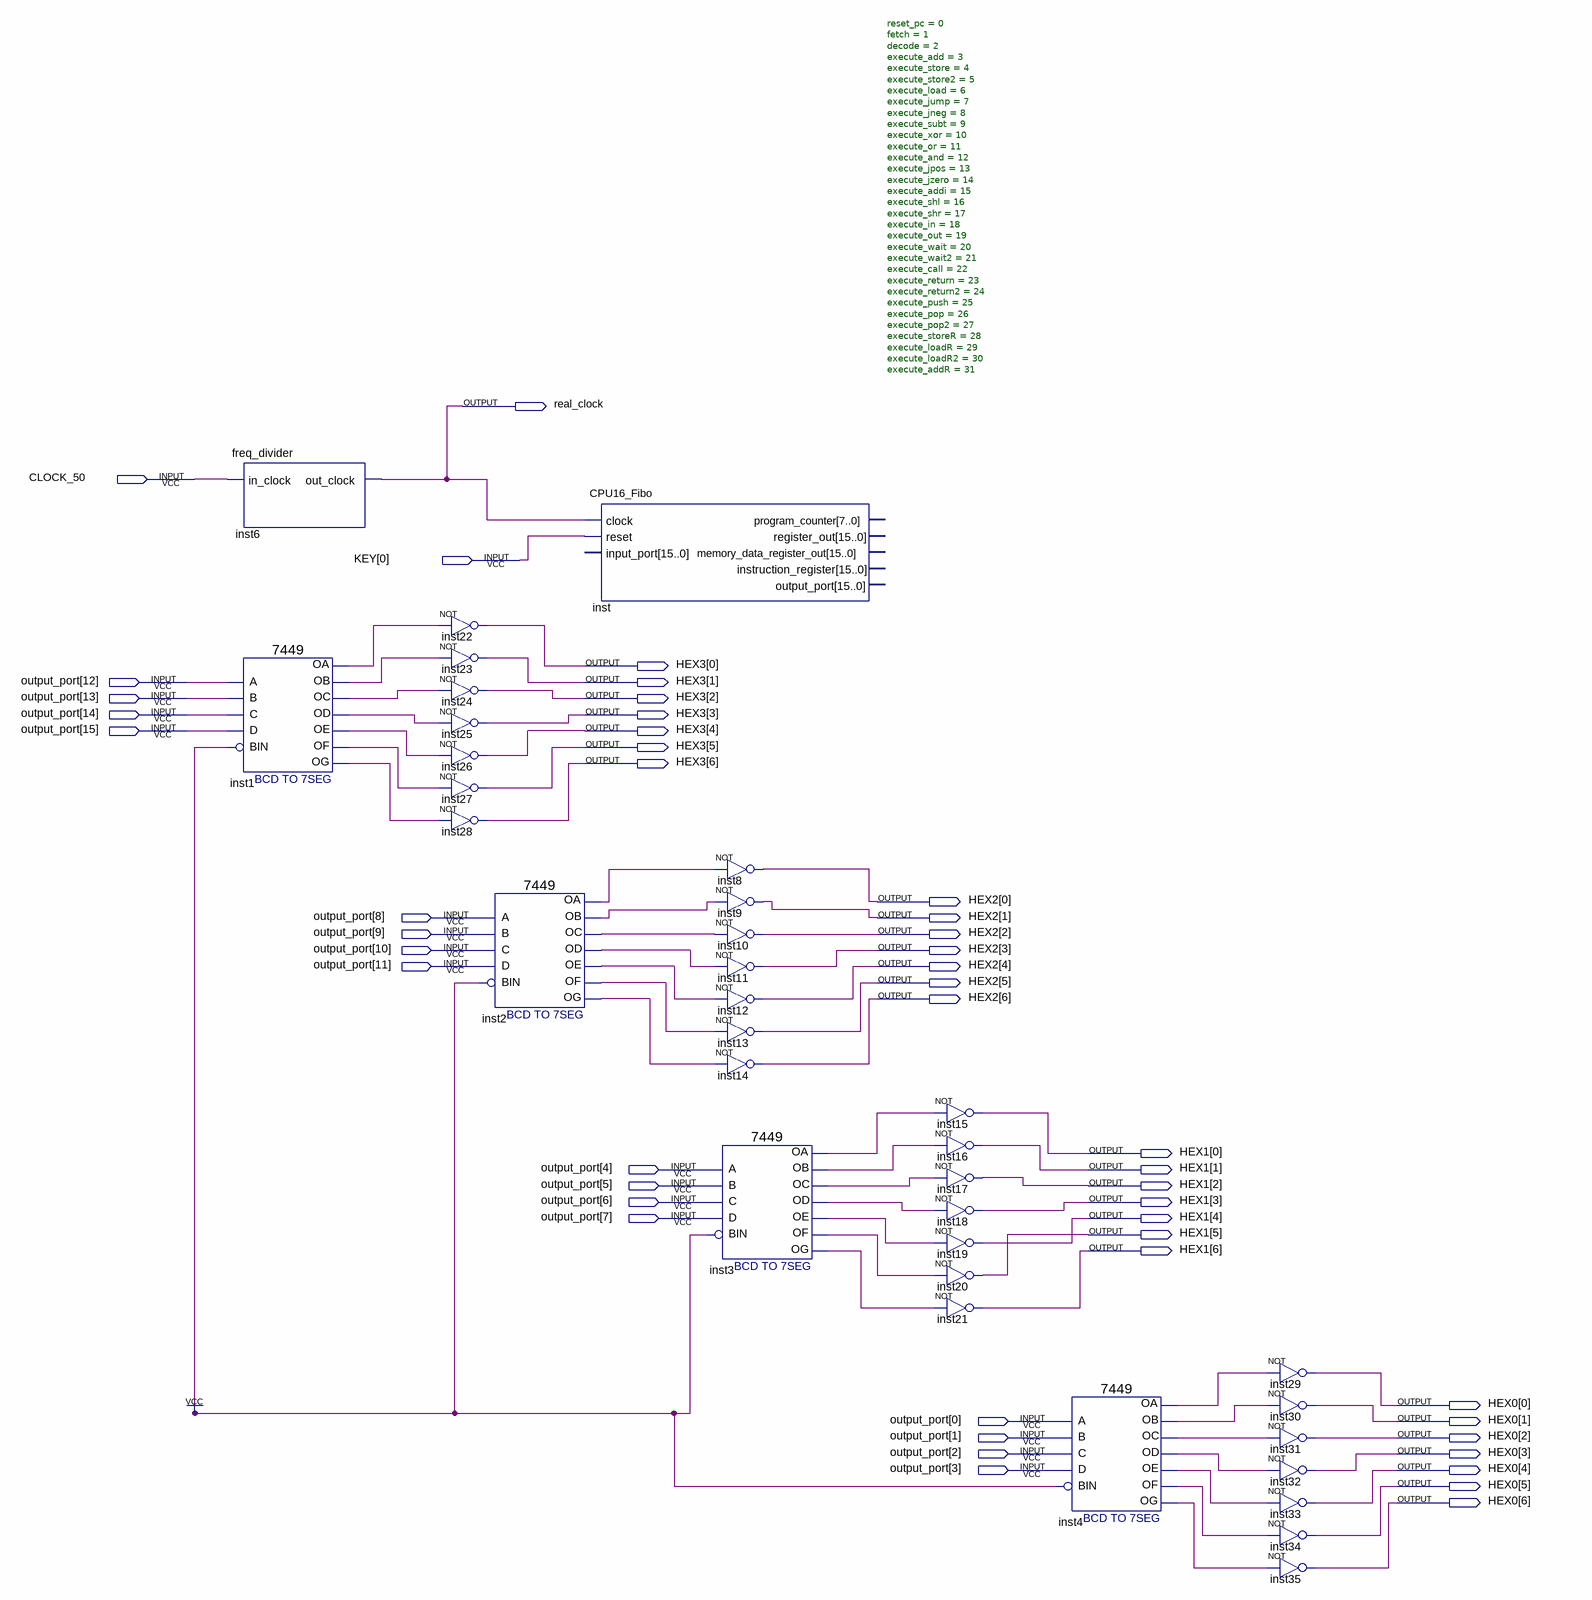
[diagram p0: schematic sheet]
// Quartus schematic fibo_circ.bdf as structural Verilog: 34 symbols, 47 pins
module fibo_circ (
  input  CLOCK_50,
  input  [0:0] KEY,
  input  [15:0] output_port,
  output real_clock,
  output [6:0] HEX3,
  output [6:0] HEX2,
  output [6:0] HEX1,
  output [6:0] HEX0
);

  wire inst1_oa, inst1_ob, inst1_oc, inst1_od, inst1_oe, inst1_of, inst1_og, inst2_oa, inst2_ob, inst2_oc,
       inst2_od, inst2_oe, inst2_of, inst2_og, inst3_oa, inst3_ob, inst3_oc, inst3_od, inst3_oe, inst3_of,
       inst3_og, inst4_oa, inst4_ob, inst4_oc, inst4_od, inst4_oe, inst4_of, inst4_og;

  freq_divider inst6 (.in_clock(CLOCK_50), .out_clock(real_clock));
  \7449  inst1 (
    .A(output_port[12]), .C(output_port[14]), .B(output_port[13]), .D(output_port[15]), .BIN(1'b1),
    .OC(inst1_oc), .OD(inst1_od), .OF(inst1_of), .OG(inst1_og), .OB(inst1_ob), .OA(inst1_oa), .OE(inst1_oe));
  not inst22 (HEX3[0], inst1_oa);
  not inst23 (HEX3[1], inst1_ob);
  not inst24 (HEX3[2], inst1_oc);
  not inst25 (HEX3[3], inst1_od);
  not inst26 (HEX3[4], inst1_oe);
  not inst27 (HEX3[5], inst1_of);
  not inst28 (HEX3[6], inst1_og);
  \7449  inst2 (
    .A(output_port[8]), .C(output_port[10]), .B(output_port[9]), .D(output_port[11]), .BIN(1'b1),
    .OC(inst2_oc), .OD(inst2_od), .OF(inst2_of), .OG(inst2_og), .OB(inst2_ob), .OA(inst2_oa), .OE(inst2_oe));
  CPU16_Fibo #(.reset_pc(0), .fetch(1), .decode(2), .execute_add(3), .execute_store(4), .execute_store2(5), .execute_load(6), .execute_jump(7), .execute_jneg(8), .execute_subt(9), .execute_xor(10), .execute_or(11), .execute_and(12), .execute_jpos(13), .execute_jzero(14), .execute_addi(15), .execute_shl(16), .execute_shr(17), .execute_in(18), .execute_out(19), .execute_wait(20), .execute_wait2(21), .execute_call(22), .execute_return(23), .execute_return2(24), .execute_push(25), .execute_pop(26), .execute_pop2(27), .execute_storeR(28), .execute_loadR(29), .execute_loadR2(30), .execute_addR(31)) inst (
    .clock(real_clock), .reset(KEY[0]));  // open: input_port, program_counter, register_out, memory_data_register_out, instruction_register, output_port
  not inst8 (HEX2[0], inst2_oa);
  not inst9 (HEX2[1], inst2_ob);
  not inst10 (HEX2[2], inst2_oc);
  not inst11 (HEX2[3], inst2_od);
  not inst12 (HEX2[4], inst2_oe);
  not inst13 (HEX2[5], inst2_of);
  not inst14 (HEX2[6], inst2_og);
  \7449  inst3 (
    .A(output_port[4]), .C(output_port[6]), .B(output_port[5]), .D(output_port[7]), .BIN(1'b1),
    .OC(inst3_oc), .OD(inst3_od), .OF(inst3_of), .OG(inst3_og), .OB(inst3_ob), .OA(inst3_oa), .OE(inst3_oe));
  not inst15 (HEX1[0], inst3_oa);
  not inst16 (HEX1[1], inst3_ob);
  not inst17 (HEX1[2], inst3_oc);
  not inst18 (HEX1[3], inst3_od);
  not inst19 (HEX1[4], inst3_oe);
  not inst20 (HEX1[5], inst3_of);
  not inst21 (HEX1[6], inst3_og);
  \7449  inst4 (
    .A(output_port[0]), .C(output_port[2]), .B(output_port[1]), .D(output_port[3]), .BIN(1'b1),
    .OC(inst4_oc), .OD(inst4_od), .OF(inst4_of), .OG(inst4_og), .OB(inst4_ob), .OA(inst4_oa), .OE(inst4_oe));
  not inst29 (HEX0[0], inst4_oa);
  not inst30 (HEX0[1], inst4_ob);
  not inst31 (HEX0[2], inst4_oc);
  not inst32 (HEX0[3], inst4_od);
  not inst33 (HEX0[4], inst4_oe);
  not inst34 (HEX0[5], inst4_of);
  not inst35 (HEX0[6], inst4_og);
endmodule
